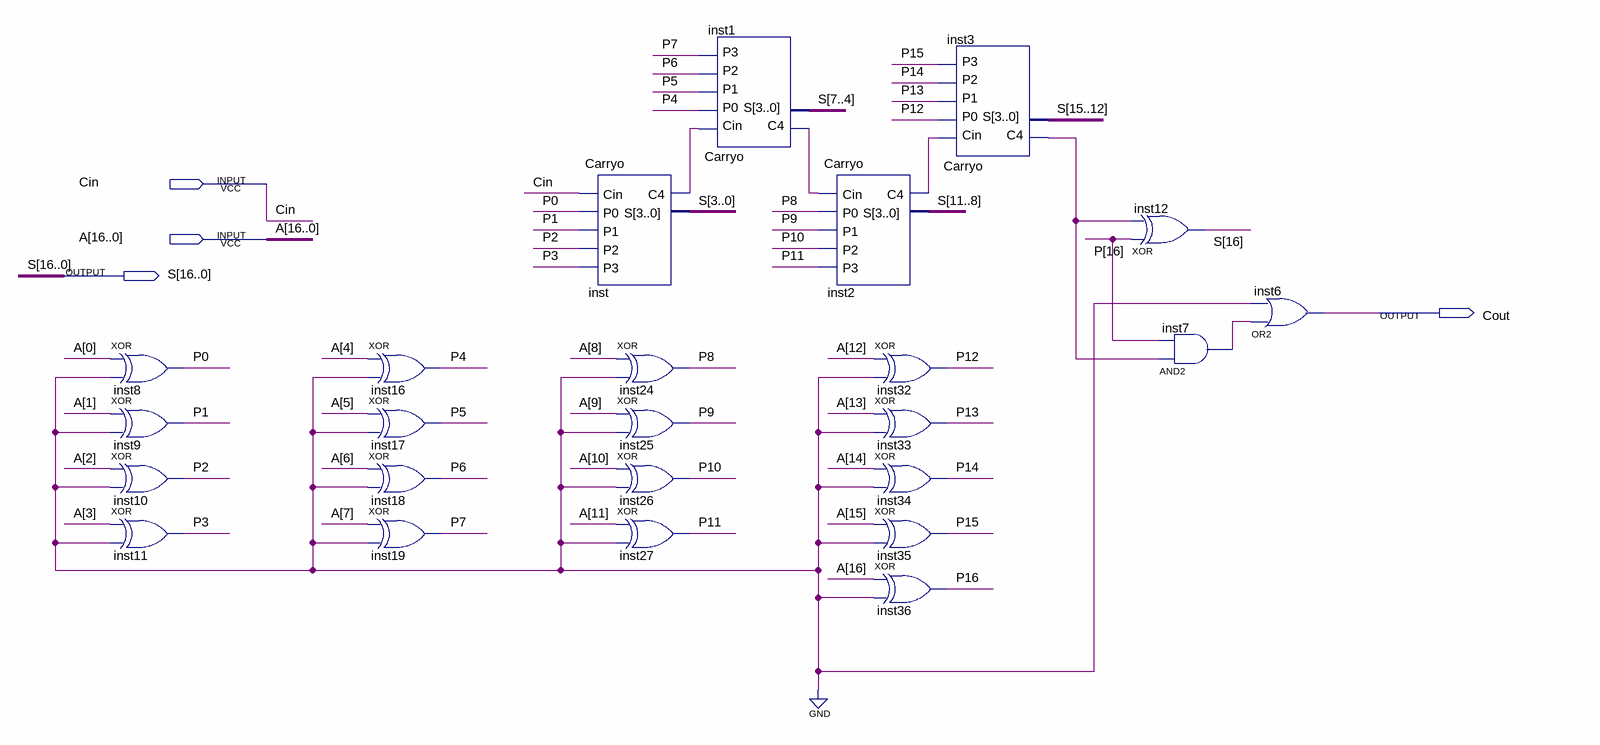
[diagram p0: schematic sheet]
// Quartus schematic CLHApl1.bdf as structural Verilog: 24 symbols, 4 pins
module CLHApl1 (
  input  Cin,
  input  [16:0] A,
  output [16:0] S,
  output Cout
);

  wire inst1_c4, inst2_c4, inst3_c4, inst7_out, inst_c4, P0, P1, P2, P3, P4, P5, P6, P7, P8, P9, P10, P11,
       P12, P13, P14, P15;
  wire [16:16] P;

  xor inst8 (P0, A[0], 1'b0);
  xor inst9 (P1, A[1], 1'b0);
  xor inst10 (P2, A[2], 1'b0);
  xor inst11 (P3, A[3], 1'b0);
  xor inst16 (P4, A[4], 1'b0);
  xor inst17 (P5, A[5], 1'b0);
  xor inst18 (P6, A[6], 1'b0);
  xor inst19 (P7, A[7], 1'b0);
  Carryo inst (.Cin(Cin), .P0(P0), .P1(P1), .P2(P2), .P3(P3), .C4(inst_c4), .S(S[3:0]));
  xor inst24 (P8, A[8], 1'b0);
  xor inst25 (P9, A[9], 1'b0);
  xor inst26 (P10, A[10], 1'b0);
  xor inst27 (P11, A[11], 1'b0);
  Carryo inst1 (.Cin(inst_c4), .P0(P4), .P1(P5), .P2(P6), .P3(P7), .C4(inst1_c4), .S(S[7:4]));
  Carryo inst2 (.Cin(inst1_c4), .P0(P8), .P1(P9), .P2(P10), .P3(P11), .C4(inst2_c4), .S(S[11:8]));
  xor inst32 (P12, A[12], 1'b0);
  xor inst33 (P13, A[13], 1'b0);
  xor inst34 (P14, A[14], 1'b0);
  xor inst35 (P15, A[15], 1'b0);
  xor inst36 (P[16], A[16], 1'b0);
  Carryo inst3 (.Cin(inst2_c4), .P0(P12), .P1(P13), .P2(P14), .P3(P15), .C4(inst3_c4), .S(S[15:12]));
  xor inst12 (S[16], P[16], inst3_c4);
  and inst7 (inst7_out, inst3_c4, P[16]);
  or inst6 (Cout, inst7_out, 1'b0);
endmodule
